# EAGLE schematic Charger Shutdown Circuit (EAGLE 8.4.1)
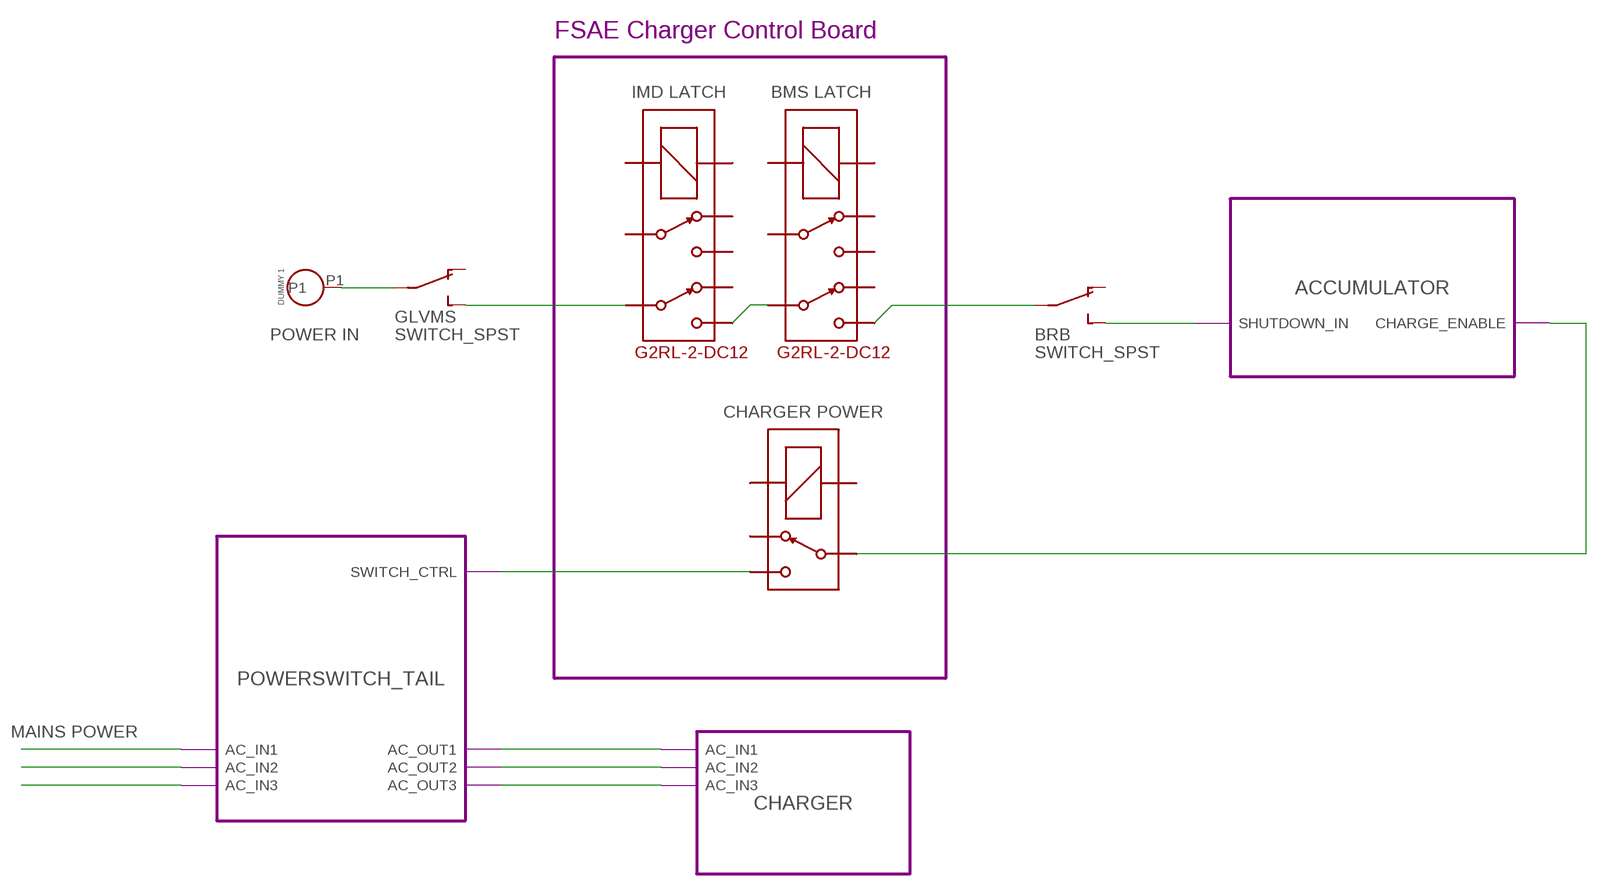
[diagram p0: schematic, sheet 1]

## Parts
BRB  SWITCH_SPST  (no package)
GLVMS  SWITCH_SPST  (no package)
POWER  DUMMY_PIN_1  [DUMMY_PIN_1]
U$1  G2RL-2-DC12  [G2RL-2]
U$2  G2RL-2-DC12  [G2RL-2]
U$3  G5LE  [ZF112]

## Module instances
ACCUMULATOR = ACCUMULATOR
POWERSWITCH_TAIL = POWERSWITCH_TAIL
CHARGER = CHARGER

## Nets
N$1: GLVMS.P POWER.P1
N$2: GLVMS.S U$1.6
N$3: U$1.5 U$2.6
N$4: BRB.P U$2.5
N$5: BRB.S ; port ACCUMULATOR.SHUTDOWN_IN
N$6: U$3.P ; port ACCUMULATOR.CHARGE_ENABLE
N$7: U$3.S ; port POWERSWITCH_TAIL.SWITCH_CTRL
N$8: port POWERSWITCH_TAIL.AC_IN1
N$9: port POWERSWITCH_TAIL.AC_IN2
N$10: port POWERSWITCH_TAIL.AC_IN3
N$11: port POWERSWITCH_TAIL.AC_OUT1 CHARGER.AC_IN1
N$12: port POWERSWITCH_TAIL.AC_OUT2 CHARGER.AC_IN2
N$13: port POWERSWITCH_TAIL.AC_OUT3 CHARGER.AC_IN3
Unconnected: BRB.O GLVMS.O U$1.2 U$1.3 U$1.4 U$1.7 U$1.COIL+ U$1.COIL- U$2.2 U$2.3 U$2.4 U$2.7 U$2.COIL+ U$2.COIL- U$3.1(COIL+) U$3.2(COIL-) U$3.O

## Notes on the sheet
- FSAE Charger Control Board
- IMD LATCH | BMS LATCH
- POWER IN
- CHARGER POWER
- MAINS POWER

## Library data of the parts
BRB GLVMS = HyTechSymbols:SWITCH_SPST: Single Pull Single Throw Switch
POWER = HyTechDevices:DUMMY_PIN_1: Adds an unused hole to a PCB. If you route an unused connector pin to this dummy, you can solder something to it later.
U$1 U$2 = HyTechDevices:G2RL-2-DC12: Omron G2RL-2 Double Pull Double Throw Relay Coil Voltage: 12VDC (8.4-18VDC @60ºC) Contact Amperage: 8A at 30VDC Datasheet <https://www.omron.com/ecb/products/pdf/en-g2rl.pdf>
U$3 = HyTechDevices:G5LE: Omron G5LE SPST Relay 5 VDC, 12VDC, 24VDC models Coil voltage: 75% - 170% of nominal voltage Datasheet <https://www.omron.com/ecb/products/pdf/en-g5le.pdf>

## Module ACCUMULATOR
Ports: SHUTDOWN_IN(in) CHARGE_ENABLE(out)

### Library data of the parts

## Module POWERSWITCH_TAIL
Ports: SWITCH_CTRL(in) AC_IN1(nc) AC_IN2(nc) AC_IN3(nc) AC_OUT1(nc) AC_OUT2(nc) AC_OUT3(nc)

### Library data of the parts

## Module CHARGER
Ports: AC_IN1(nc) AC_IN2(nc) AC_IN3(nc)

### Library data of the parts